# Altium schematic sheet GPRS_ModuleV3R.SchDoc
size A4
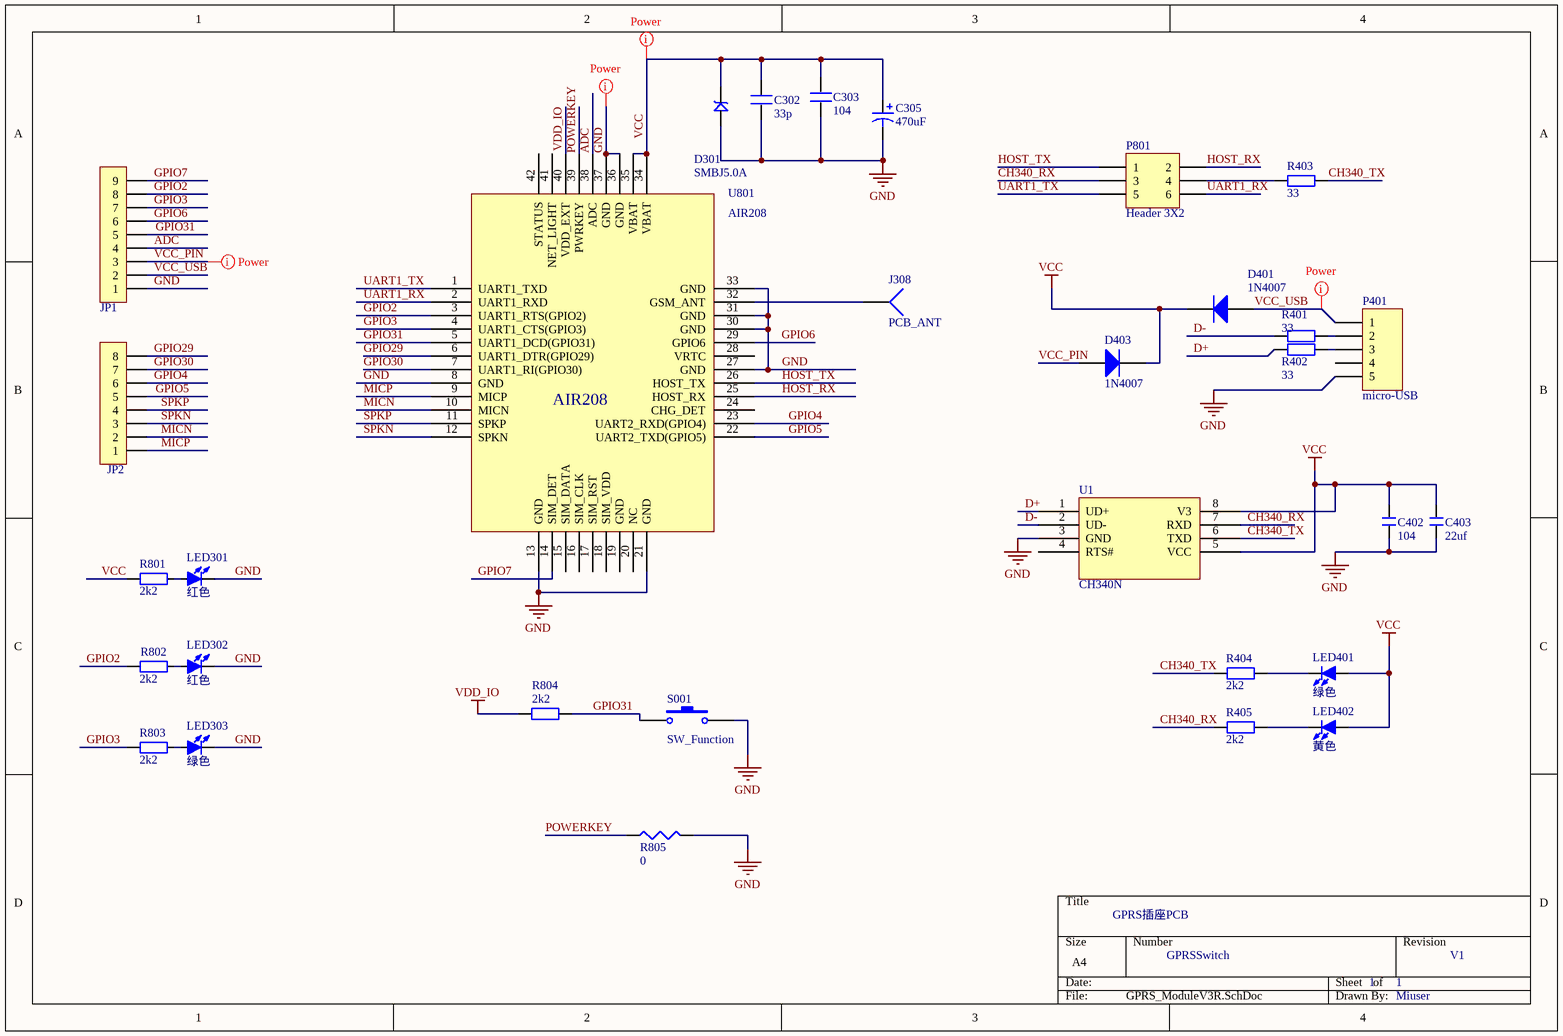
[diagram p0: GPRS_ModuleV3R.SchDoc]

## Parts
C302  33p  [C 0603]
C303  104  [C 0805]
C305  470uF  [CD D(7343)]
C402  104  [C 0805]
C403  22uf  [C 0805]
D301  SMBJ5.0A  [SMC]
D401  1N4007  [SMB]
D403  1N4007  [SMB]
J308  PCB_ANT  [GSMANT2]
JP1  HDR-1X9  [HDR-1X9]  (value not drawn)
JP2  HDR-1X8  [HDR-1X8]  (value not drawn)
LED301  红色  [LED 0603R]
LED302  红色  [LED 0603R]
LED303  绿色  [LED 0603G]
LED401  绿色  [LED 0603G]
LED402  黄色  [LED 0603Y]
P401  micro-USB  [USB-micro_B]
P801  Header 3X2  [HDR2X3]
R401  33  [R 0603]
R402  33  [R 0603]
R403  33  [R 0603]
R404  2k2  [R 0603]
R405  2k2  [R 0603]
R801  2k2  [R 0603]
R802  2k2  [R 0603]
R803  2k2  [R 0603]
R804  2k2  [R 0603]
R805  0  [R 0603]
S001  SW_Function  [TSW SMD-3*6*2.5]
U1  CH340N  [SOP8_M]
U801  AIR208  [AIR208]

## Nets
GND: C302.1 C303.1 C305.2 C402.1 C403.1 D301.1 JP1.1 LED301.2(K) LED302.2(K) LED303.2(K) P401.5 R805.2 S001.2 U1.3(GND) U801.8(GND) U801.13(GND) U801.21(GND) U801.27(GND) U801.30(GND) U801.31(GND) U801.33(GND) U801.36(GND) U801.37(GND)
VCC: C302.2 C303.2 C305.1 C402.2 C403.2 D301.2 D401.2(K) D403.2(K) LED401.1(A) LED402.1(A) R801.1 U1.5(VCC) U1.8(V3) U801.34(VBAT) U801.35(VBAT)
VDD_IO: R804.1 U801.40(VDD_EXT)
ADC: JP1.4 U801.38(ADC)
CH340_RX: P801.3 R405.1 U1.7(RXD)
CH340_TX: R403.2 R404.1 U1.6(TXD)
D+: R402.1 U1.1(UD+)
D-: R401.1 U1.2(UD-)
GPIO2: JP1.8 R802.1 U801.3(UART1_RTS(GPIO2))
GPIO3: JP1.7 R803.1 U801.4(UART1_CTS(GPIO3))
GPIO4: JP2.6 U801.23(UART2_RXD(GPIO4))
GPIO5: JP2.5 U801.22(UART2_TXD(GPIO5))
GPIO6: JP1.6 U801.29(GPIO6)
GPIO7: JP1.9 U801.14(SIM_DET)
GPIO29: JP2.8 U801.6(UART1_DTR(GPIO29))
GPIO30: JP2.7 U801.7(UART1_RI(GPIO30))
GPIO31: JP1.5 R804.2 S001.1 U801.5(UART1_DCD(GPIO31))
HOST_RX: P801.2 U801.25(HOST_RX)
HOST_TX: P801.1 U801.26(HOST_TX)
MICN: JP2.2 U801.10(MICN)
MICP: JP2.1 U801.9(MICP)
POWERKEY: R805.1 U801.39(PWRKEY)
SPKN: JP2.3 U801.12(SPKN)
SPKP: JP2.4 U801.11(SPKP)
UART1_RX: P801.6 U801.2(UART1_RXD)
UART1_TX: P801.5 U801.1(UART1_TXD)
VCC_PIN: D403.1(A) JP1.3
VCC_USB: D401.1(A) JP1.2 P401.1
NetJ308_1: J308.1 U801.32(GSM_ANT)
NetLED301_1: LED301.1(A) R801.2
NetLED302_1: LED302.1(A) R802.2
NetLED303_1: LED303.1(A) R803.2
NetLED401_2: LED401.2(K) R404.2
NetLED402_2: LED402.2(K) R405.2
NetP401_2: P401.2 R401.2
NetP401_3: P401.3 R402.2
NetP801_4: P801.4 R403.1

Not connected (* = marked no-connect by the designer): P401 4; U1 4(RTS#); U801 15(SIM_DATA) 16(SIM_CLK) 17(SIM_RST) 18(SIM_VDD) 19(GND) 20(NC) 24(CHG_DET) 28(VRTC) 41(NET_LIGHT) 42(STATUS)

## Layout directives
net class Power: GND, VCC, VCC_PIN, VCC_USB

## Notes on the sheet
- GPRS插座PCB
- GPRSSwitch
- 1
- V1
- Miuser

## Library data of the parts
C302 C303 = C
C305 = Cap Pol1: Polarized Capacitor (Radial); Value: 100pF; Published: 8-Jun-2000; LatestRevisionDate: 17-Jul-2002; LatestRevisionNote: Re-released for DXP Platform.; PackageReference: RB7.6-15; Publisher: Altium Limited; PackageDescription: Polarized Capacitor (Radial); 2 Leads
C402 C403 = C: 无极性贴片电容; 版权归属: 源创客; BOM名称: 无极性贴片电容; 学习资源: www.ooocke.com
D301 = SMBJ: TVS
D401 D403 = Diode 1N4001: 1 Amp General Purpose Rectifier; Published: 8-Jun-2000; LatestRevisionDate: 17-Jul-2002; LatestRevisionNote: Re-released for DXP Platform.; DatasheetVersion: 1998; PackageVersion: Aug-1999; PackageReference: DO-41; Publisher: Altium Limited; PackageDescription: Diode, Axial; Body 5.2 x 2.7 mm (LxDia. max), Lead Dia. 0.86 mm (max); Code_JEDEC: DO-204-AL; ComponentLink1Description: Manufacturer Link; ComponentLink1URL: http://www.fairchildsemi.com/; ComponentLink2Description: Datasheet; ComponentLink2URL: http://www.fairchildsemi.com/ds/1N%2F1N4001.pdf
J308 = Socket: LatestRevisionDate: 17-Jul-2002; LatestRevisionNote: Re-released for DXP Platform.; Publisher: Altium Limited
JP1 = Header 9: 9P接插件; 版权归属: 源创客; BOM名称: 9P接插件; 学习资源: www.ooocke.com
JP2 = Header 8: 8P接插件; 版权归属: 源创客; BOM名称: 8P接插件; 学习资源: www.ooocke.com
LED301-LED303 LED401 LED402 = LED-SMD: 贴片LED; 版权归属: 源创客; BOM名称: 贴片LED; 学习资源: www.ooocke.com
P401 = Header 5: Header, 5-Pin; LatestRevisionDate: 17-Jul-2002; LatestRevisionNote: Re-released for DXP Platform.; Publisher: Altium Limited
P801 = Header 3X2: Header, 3-Pin, Dual row; LatestRevisionDate: 17-Jul-2002; LatestRevisionNote: Re-released for DXP Platform.; Publisher: Altium Limited
R401 R402 R804 = Res2: Resistor; Value: 1K; Published: 8-Jun-2000; LatestRevisionDate: 17-Jul-2002; LatestRevisionNote: Re-released for DXP Platform.; PackageReference: AXIAL-0.4; Publisher: Altium Limited; PackageDescription: Axial Device, Thru-Hole; 2 Leads; 0.4 in Pin Spacing
R403-R405 R801-R803 = R: 贴片电阻; 版权归属: 源创客; BOM名称: 贴片电阻; 学习资源: www.ooocke.com
R805 = Res3: Resistor; Value: 1K; Published: 8-Jun-2000; LatestRevisionDate: 29-May-2009; LatestRevisionNote: IPC-7351 Footprint Added.; PackageReference: J1-0603; Publisher: Altium Limited; PackageDescription: Chip Resistor
S001 = SW-PB: 轻触开关/3x6x2.5; Published: 24-Mar-1999; LatestRevisionDate: 17-Jul-2002; LatestRevisionNote: Re-released for DXP Platform.; PackageReference: SPST-2; Publisher: Altium Limited; PackageDescription: Switch; 2 Leads